# Altium schematic sheet buttons.SchDoc
size A
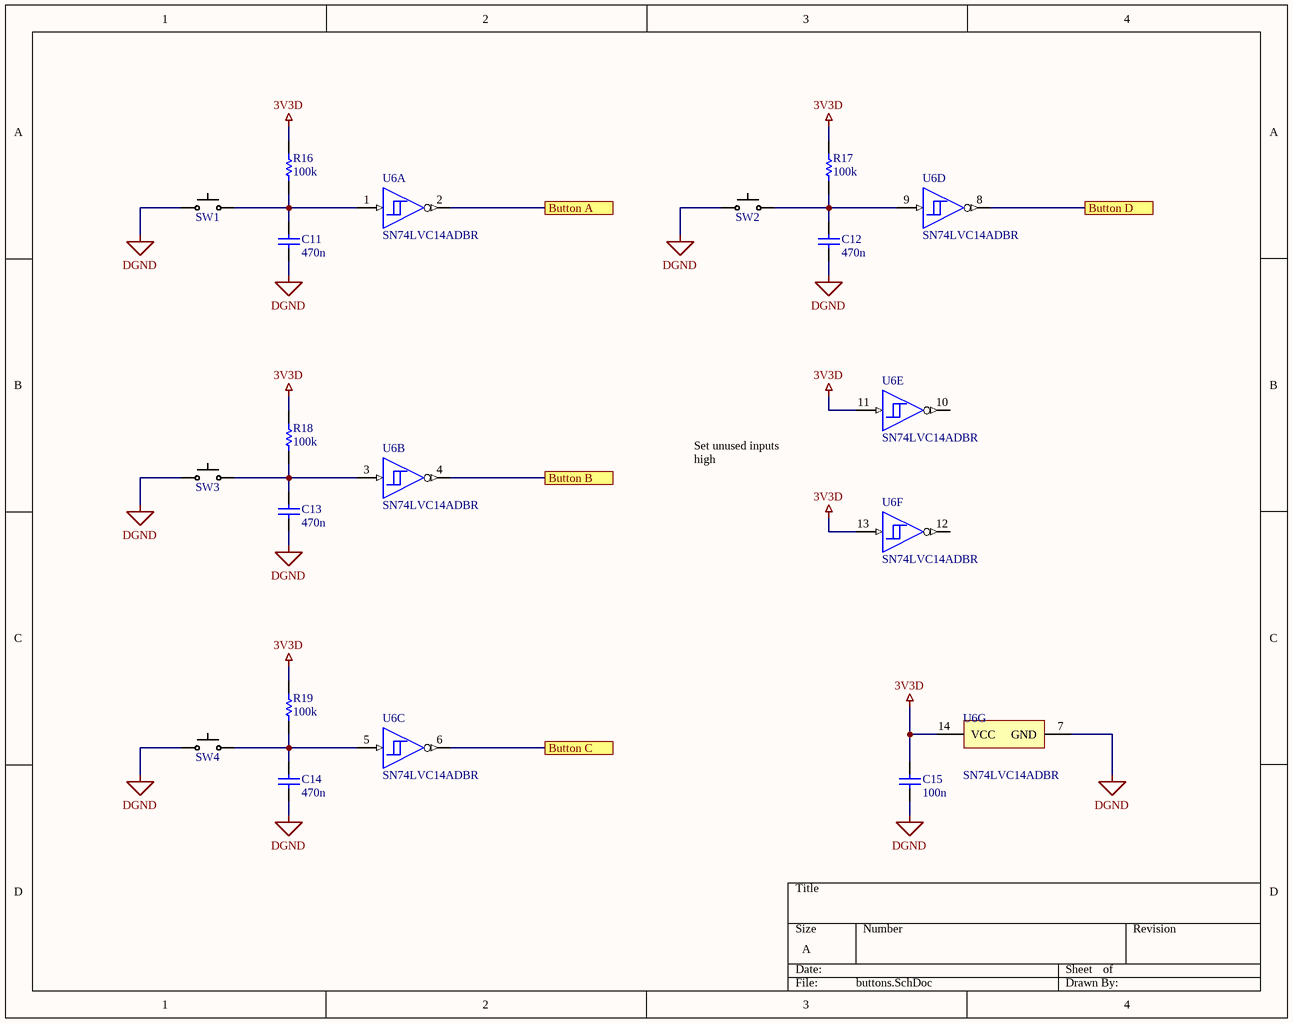
[diagram p0: buttons.SchDoc]

## Parts
C11  value 470n  [C0805_med_density]  (hidden comment: CapCer)
C12  value 470n  [C0805_med_density]  (hidden comment: CapCer)
C13  value 470n  [C0805_med_density]  (hidden comment: CapCer)
C14  value 470n  [C0805_med_density]  (hidden comment: CapCer)
C15  value 100n  [C0805_med_density]  (hidden comment: CapCer)
R16  value 100k  [R0805_med_density]  (hidden comment: ResChip)
R17  value 100k  [R0805_med_density]  (hidden comment: ResChip)
R18  value 100k  [R0805_med_density]  (hidden comment: ResChip)
R19  value 100k  [R0805_med_density]  (hidden comment: ResChip)
SW1  Switch  [PUSHBUTTON]  (value not drawn)
SW2  Switch  [PUSHBUTTON]  (value not drawn)
SW3  Switch  [PUSHBUTTON]  (value not drawn)
SW4  Switch  [PUSHBUTTON]  (value not drawn)
U6  SN74LVC14ADBR  [SOP-14]  (parts A,B,C,D,E,F,G of 7)

## Ports
Button A, Button B, Button C, Button D

## Nets
3V3D: C15.1 R16.2 R17.2 R18.2 R19.2 U6.11(5A) U6.13(6A) U6.14(VCC)
DGND: C11.2 C12.2 C13.2 C14.2 C15.2 SW1.2 SW2.2 SW3.2 SW4.2 U6.7(GND)
Button A: U6.2(~{1Y}) ; port Button A
Button B: U6.4(~{2Y}) ; port Button B
Button C: U6.6(~{3Y}) ; port Button C
Button D: U6.8(~{4Y}) ; port Button D
NetC11_1: C11.1 R16.1 SW1.1 U6.1(1A)
NetC12_1: C12.1 R17.1 SW2.1 U6.9(4A)
NetC13_1: C13.1 R18.1 SW3.1 U6.3(2A)
NetC14_1: C14.1 R19.1 SW4.1 U6.5(3A)

Not connected (* = marked no-connect by the designer): U6 10(~{5Y}) 12(~{6Y})

## Notes on the sheet
- Set unused inputs high

## Library data of the parts
C11-C15 = CapCer: SMD Ceramic Capacitor; Rating: 6.3V; Tolerance: *; EIA RS-198 Code: *; Package: *
R16-R19 = ResChip: SMD Chip resistor; Tolerance: *; Rating: *; Package: *
SW1-SW4 = Switch: Push button switch, momentary, normally open
U6 = SN74LVC14: Hex Schmitt-Trigger Inverter, DB0014A, LARGE T&R; Manufacturer: Texas Instruments; tpd @ Nom Voltage(Max)(ns): 11,7.8,7.5,6.4; Output Type: CMOS; Voltage(Nom)(V): 1.8,2.5,2.7,3.3; F @ Nom Voltage(Max)(Mhz): 100; ICC @ Nom Voltage(Max)(mA): 0.01; Input Type: CMOS,TTL; VCC(Max)(V): 3.6; Schmitt Trigger: Yes; Technology Family: LVC; VCC(Min)(V): 2; Output Drive (IOL/IOH)(Max)(mA): -24/24; Bits(#): 6; Rating: Catalog; Code_JEDEC: MO-150; PackageReference: DB0014A; Generic Part Number: SN74LVC14A; Operating Temperature Range(C): -40 to 125; DatasheetVersion: SCAS285AA